# Altium project pcb_malo.PrjPcb
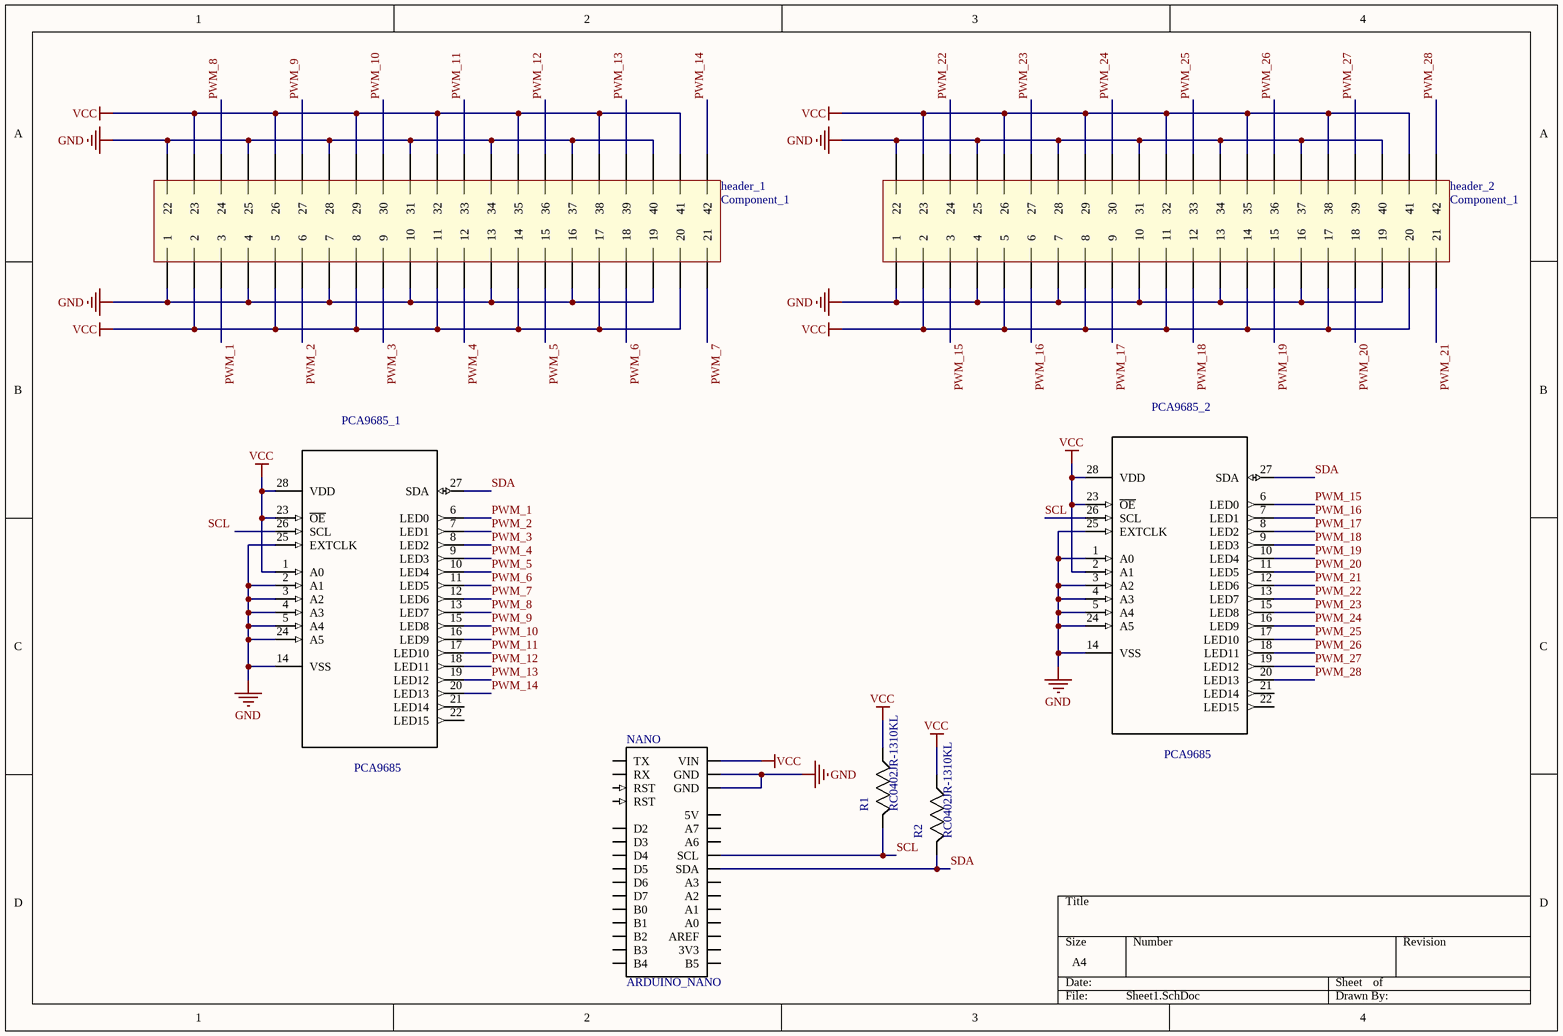
[diagram p0: Sheet1.SchDoc]
1 sheet, 7 parts. Net scope: global (net labels, ports and power ports of the same name join across sheets).
Board file: PCB1.PcbDoc

## Sheet Sheet1.SchDoc
size A4

### Parts
header_1  Component_1  [PCBComponent_1]
header_2  Component_1  [PCBComponent_1]
NANO  ARDUINO_NANO  [*ARDUINO_NANO]
PCA9685_1  PCA9685  [*SOP65P640X110-28N]
PCA9685_2  PCA9685  [*SOP65P640X110-28N]
R1  RC0402JR-1310KL  [*RESC1005X40]
R2  RC0402JR-1310KL  [*RESC1005X40]

### Nets
GND: header_1.1 header_1.4 header_1.7 header_1.10 header_1.13 header_1.16 header_1.19 header_1.22 header_1.25 header_1.28 header_1.31 header_1.34 header_1.37 header_1.40 header_2.1 header_2.4 header_2.7 header_2.10 header_2.13 header_2.16 header_2.19 header_2.22 header_2.25 header_2.28 header_2.31 header_2.34 header_2.37 header_2.40 NANO.4(GND) NANO.29(GND) PCA9685_1.2(A1) PCA9685_1.3(A2) PCA9685_1.4(A3) PCA9685_1.5(A4) PCA9685_1.14(VSS) PCA9685_1.24(A5) PCA9685_1.25(EXTCLK) PCA9685_2.1(A0) PCA9685_2.3(A2) PCA9685_2.4(A3) PCA9685_2.5(A4) PCA9685_2.14(VSS) PCA9685_2.24(A5) PCA9685_2.25(EXTCLK)
VCC: header_1.2 header_1.5 header_1.8 header_1.11 header_1.14 header_1.17 header_1.20 header_1.23 header_1.26 header_1.29 header_1.32 header_1.35 header_1.38 header_1.41 header_2.2 header_2.5 header_2.8 header_2.11 header_2.14 header_2.17 header_2.20 header_2.23 header_2.26 header_2.29 header_2.32 header_2.35 header_2.38 header_2.41 NANO.30(VIN) PCA9685_1.1(A0) PCA9685_1.23(~{OE}) PCA9685_1.28(VDD) PCA9685_2.2(A1) PCA9685_2.23(~{OE}) PCA9685_2.28(VDD) R1.2 R2.2
PWM_1: header_1.3 PCA9685_1.6(LED0)
PWM_2: header_1.6 PCA9685_1.7(LED1)
PWM_3: header_1.9 PCA9685_1.8(LED2)
PWM_4: header_1.12 PCA9685_1.9(LED3)
PWM_5: header_1.15 PCA9685_1.10(LED4)
PWM_6: header_1.18 PCA9685_1.11(LED5)
PWM_7: header_1.21 PCA9685_1.12(LED6)
PWM_8: header_1.24 PCA9685_1.13(LED7)
PWM_9: header_1.27 PCA9685_1.15(LED8)
PWM_10: header_1.30 PCA9685_1.16(LED9)
PWM_11: header_1.33 PCA9685_1.17(LED10)
PWM_12: header_1.36 PCA9685_1.18(LED11)
PWM_13: header_1.39 PCA9685_1.19(LED12)
PWM_14: header_1.42 PCA9685_1.20(LED13)
PWM_15: header_2.3 PCA9685_2.6(LED0)
PWM_16: header_2.6 PCA9685_2.7(LED1)
PWM_17: header_2.9 PCA9685_2.8(LED2)
PWM_18: header_2.12 PCA9685_2.9(LED3)
PWM_19: header_2.15 PCA9685_2.10(LED4)
PWM_20: header_2.18 PCA9685_2.11(LED5)
PWM_21: header_2.21 PCA9685_2.12(LED6)
PWM_22: header_2.24 PCA9685_2.13(LED7)
PWM_23: header_2.27 PCA9685_2.15(LED8)
PWM_24: header_2.30 PCA9685_2.16(LED9)
PWM_25: header_2.33 PCA9685_2.17(LED10)
PWM_26: header_2.36 PCA9685_2.18(LED11)
PWM_27: header_2.39 PCA9685_2.19(LED12)
PWM_28: header_2.42 PCA9685_2.20(LED13)
SCL: NANO.24(SCL) PCA9685_2.26(SCL) R1.1
SDA: NANO.23(SDA) PCA9685_1.27(SDA) PCA9685_2.27(SDA) R2.1

Not connected (* = marked no-connect by the designer): NANO 1(TX) 2(RX) 3(RST) 5(D2) 6(D3) 7(D4) 8(D5) 9(D6) 10(D7) 11(B0) 12(B1) 13(B2) 14(B3) 15(B4) 16(B5) 17(3V3) 18(AREF) 19(A0) 20(A1) 21(A2) 22(A3) 25(A6) 26(A7) 27(5V) 28(RST); PCA9685_1 21(LED14) 22(LED15) 26(SCL); PCA9685_2 21(LED14) 22(LED15)

### Notes on the sheet
- Labels drawn without touching a wire or pin: SCL

### Library data of the parts
NANO = ARDUINO_NANO: Dev.kit: Arduino; UART; ICSP, USB B mini, pin strips; MP: ARDUINO NANO; MF: Arduino; Package: None; SnapEDA_Link: https://www.snapeda.com/parts/ARDUINO%20NANO/Arduino/view-part/?ref=snap; Price: None; Availability: Unavailable; Value: *
PCA9685_1 PCA9685_2 = PCA9685PW,118: PCA9685 Series 5.5V 25 mA 1 MHz 12-bit PWM Fm+I2C-Bus LED Controller - TSSOP-28; MF: NXP USA; MP: PCA9685PW,118; Price: None; Package: TSSOP-28 NXP Semiconductors; Availability: Unavailable; SnapEDA_Link: https://www.snapeda.com/parts/PCA9685PW%2C118/NXP%20USA%20Inc./view-part/?ref=snap; Value: *
R1 R2 = RC0402JR-1310KL: Res, Thick Film, 10k, 5%, 0.0625w, 0402; MF: Yageo; Price: None; MP: RC0402JR-1310KL; Package: 0402 Yageo; Availability: Unavailable; SnapEDA_Link: https://www.snapeda.com/parts/RC0402JR-1310KL/Yageo/view-part/?ref=snap; Value: *